# Altium schematic sheet 06.Lower-Speed Bus Map.SchDoc
size 594 x 420 mm; Revision: V2.1; Schematic Page Number: 11; Page Number: 7; Check: <Checker>; Schematic Name: RK_NVR_DEMO1_RK3588_LP4/4x_V21; Page Count: 43; Page name: 06.Lower-Speed Bus Map; Designer: Zhangdz; Schematic Page Count: 99; Revcode: V2.1; DsnPath: E:\Work\SBER\RK3588_SOM\temp\RK_NVR_DEMO1_RK3588_LP4XD200P232SD8_V21_20211228.DSN; SchematicName: RK_NVR_DEMO1_RK3588_LP4/4x_V21; PageName: 06.Lower-Speed Bus Map; PageSize: A2; TopSchematic: True
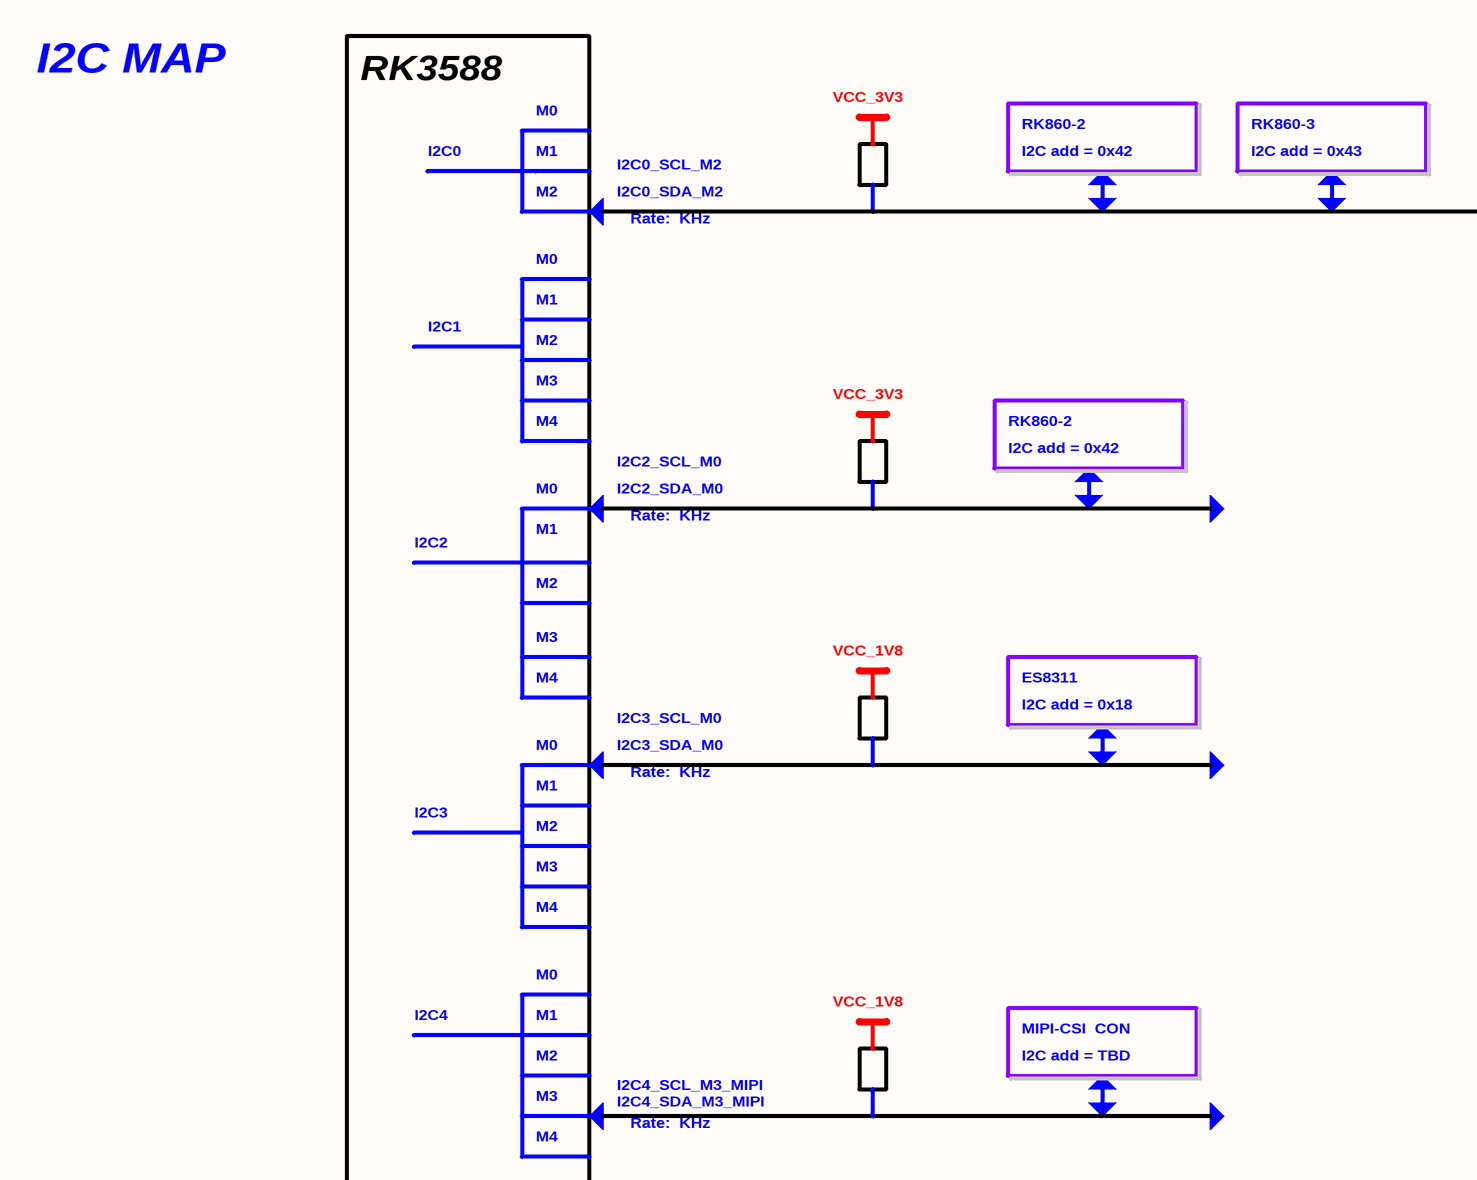
[diagram p0: 06.Lower-Speed Bus Map.SchDoc, top left]
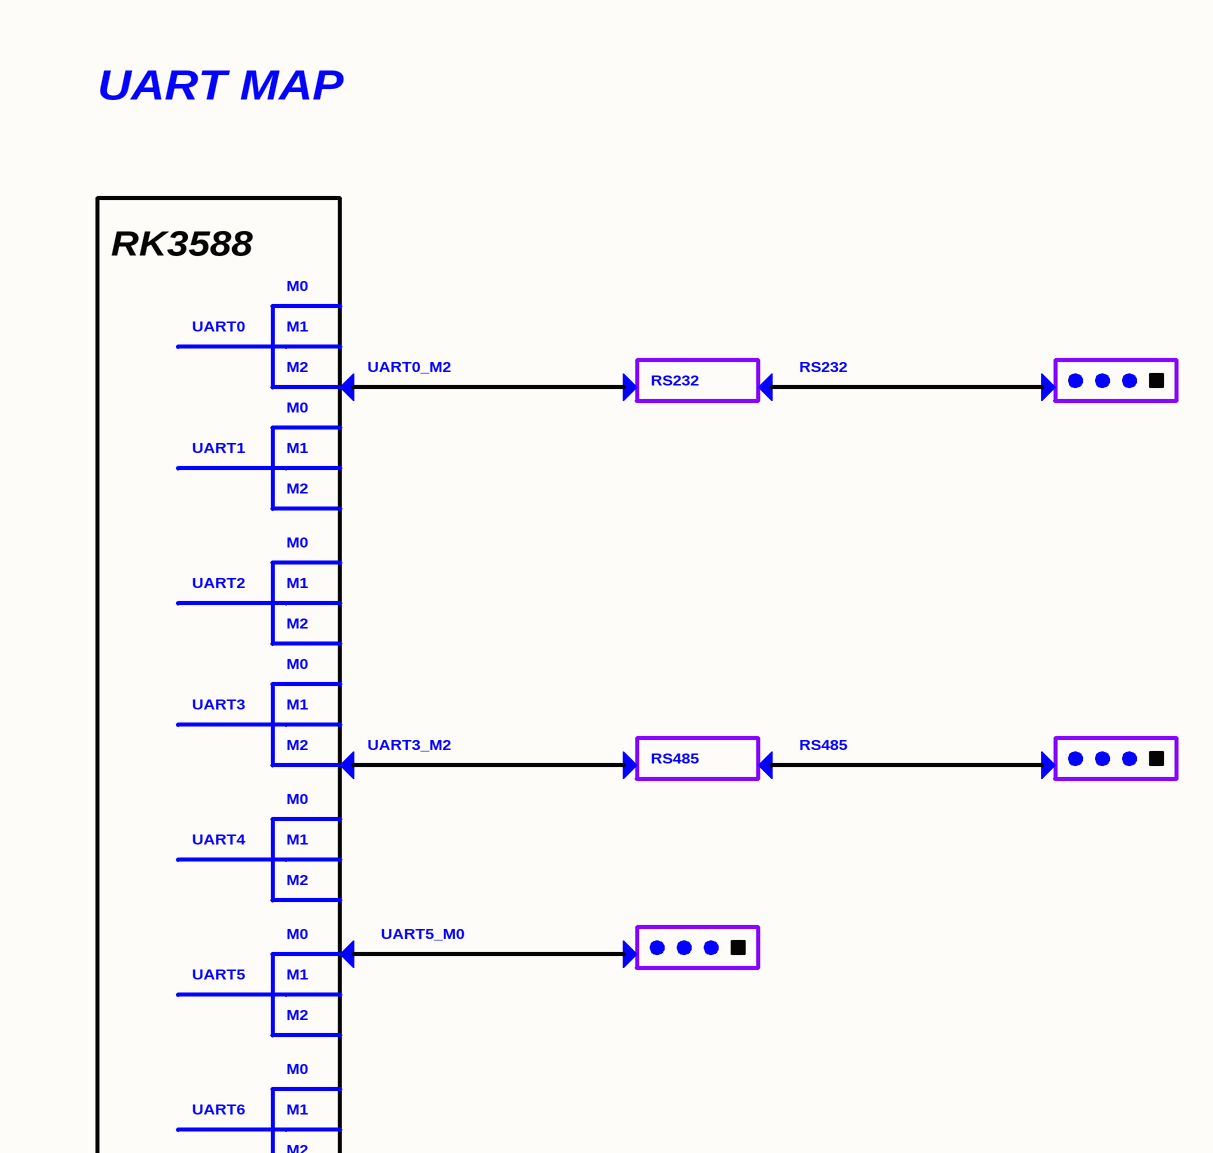
[diagram p1: 06.Lower-Speed Bus Map.SchDoc, top right]
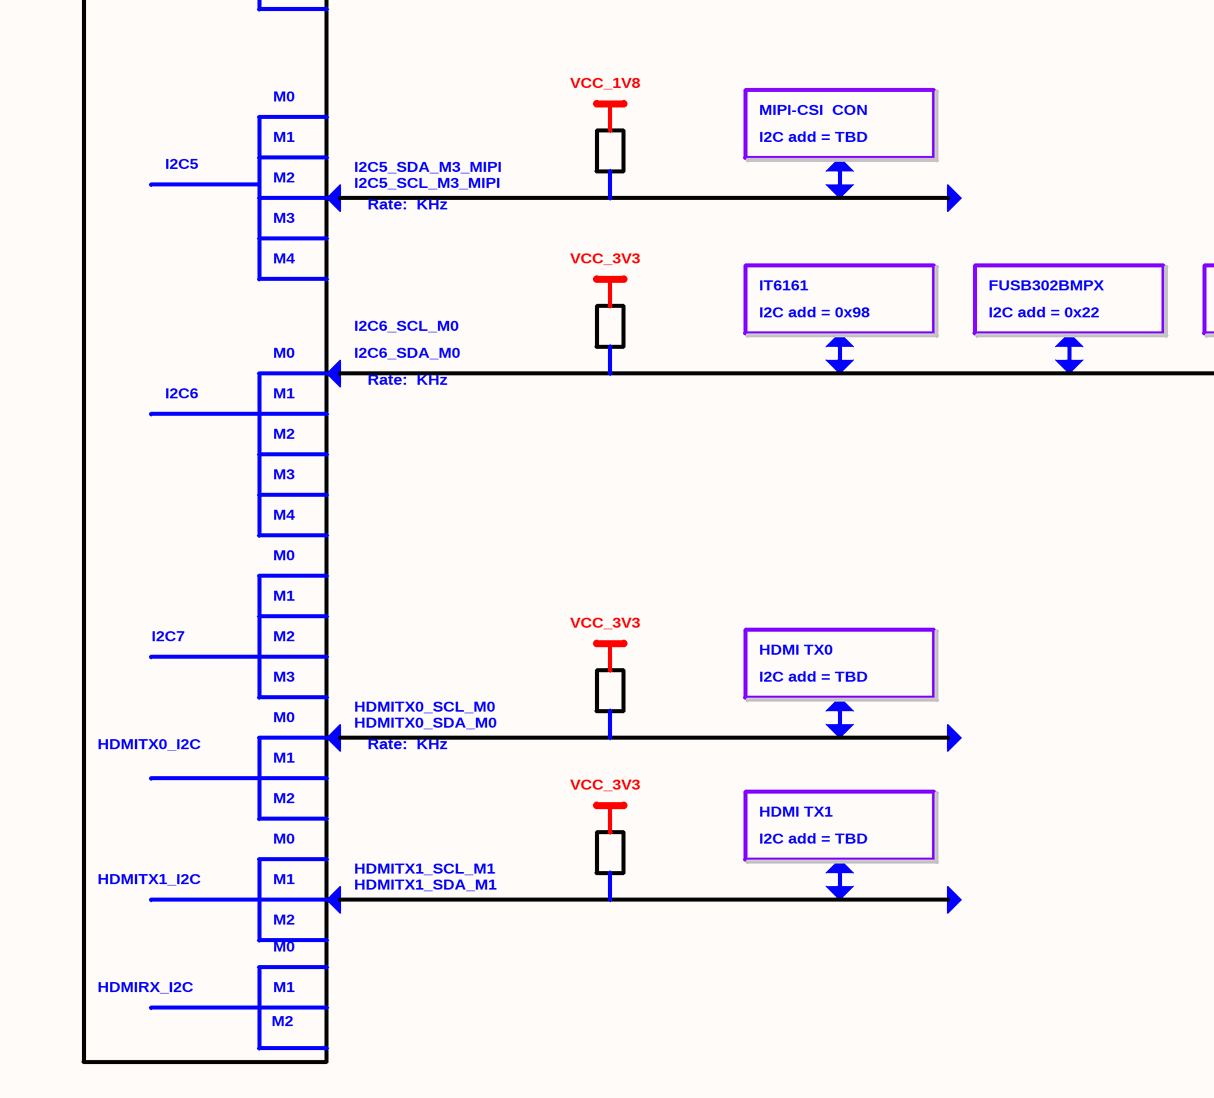
[diagram p2: 06.Lower-Speed Bus Map.SchDoc, bottom left]
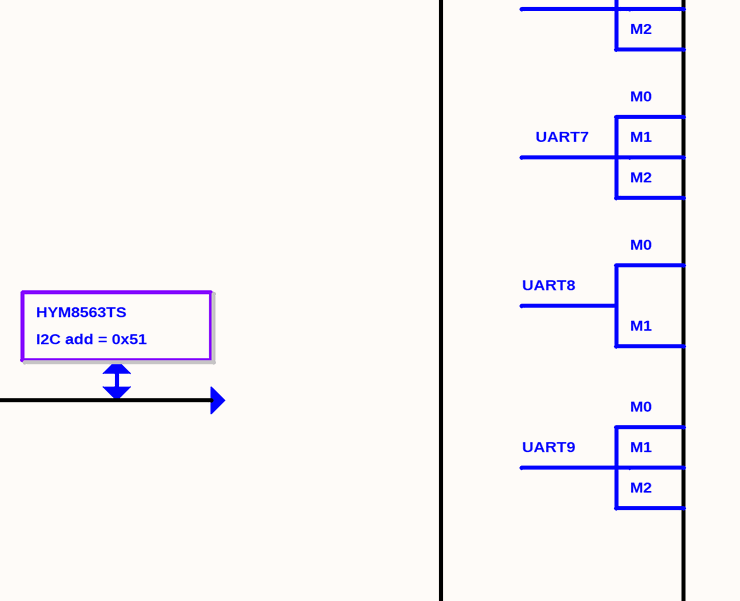
[diagram p3: 06.Lower-Speed Bus Map.SchDoc, bottom right]

## Notes on the sheet
- I2C MAP
- RK3588
- VCC_3V3
- UART MAP
- I2C0
- M1
- M0
- I2C0_SCL_M2
- RK860-2
- I2C add = 0x42
- RK860-3
- I2C add = 0x43
- M2
- I2C0_SDA_M2
- Rate:  KHz
- I2C1
- UART0
- UART0_M2
- RS232
- M3
- M4
- I2C2_SCL_M0
- I2C2_SDA_M0
- UART1
- I2C2
- UART2
- VCC_1V8
- ES8311
- I2C add = 0x18
- UART3
- I2C3_SDA_M0
- I2C3_SCL_M0
- UART3_M2
- RS485
- I2C3
- UART4
- UART5
- UART5_M0
- I2C4
- MIPI-CSI  CON
- I2C4_SCL_M3_MIPI
  I2C4_SDA_M3_MIPI
- I2C add = TBD
- UART6
- I2C5
- UART7
- I2C5_SDA_M3_MIPI
  I2C5_SCL_M3_MIPI
- IT6161
- FUSB302BMPX
- HYM8563TS
- UART8
- I2C6_SDA_M0
- I2C6_SCL_M0
- I2C add = 0x98
- I2C add = 0x22
- I2C add = 0x51
- I2C6
- UART9
- I2C7
- HDMI TX0
- HDMITX0_I2C
- HDMITX0_SCL_M0
  HDMITX0_SDA_M0
- HDMI TX1
- HDMITX1_I2C
- HDMITX1_SCL_M1
  HDMITX1_SDA_M1
- HDMIRX_I2C